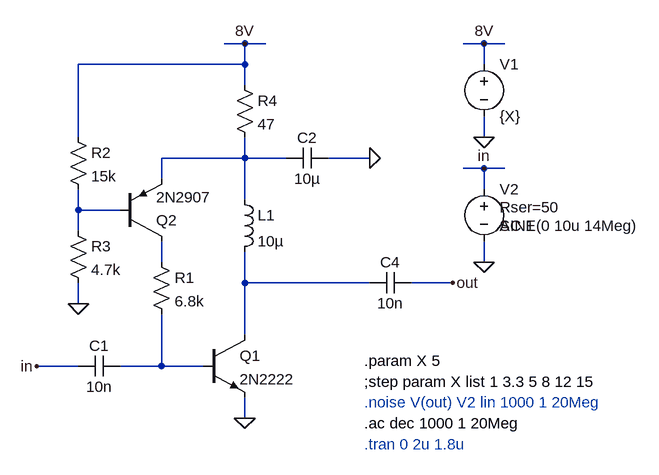
[diagram p0: schematic j-lna.asc]
j-lna.asc, the LTspice schematic file:
Version 4
SHEET 1 1132 680
WIRE 64 -176 32 -176
WIRE 96 -176 64 -176
WIRE 432 -176 400 -176
WIRE 464 -176 432 -176
WIRE 64 -144 64 -176
WIRE 64 -144 -192 -144
WIRE 432 -144 432 -176
WIRE 64 -112 64 -144
WIRE -192 -32 -192 -144
WIRE 432 -32 432 -64
WIRE 64 0 64 -32
WIRE 64 0 -64 0
WIRE 128 0 64 0
WIRE 256 0 192 0
WIRE 432 16 400 16
WIRE 464 16 432 16
WIRE -64 32 -64 0
WIRE 432 48 432 16
WIRE 64 64 64 0
WIRE -192 80 -192 48
WIRE -128 80 -192 80
WIRE -192 112 -192 80
WIRE -64 160 -64 128
WIRE 432 160 432 128
WIRE 64 192 64 144
WIRE 256 192 64 192
WIRE 384 192 320 192
WIRE -192 224 -192 192
WIRE 64 272 64 192
WIRE -192 320 -256 320
WIRE -64 320 -64 240
WIRE -64 320 -128 320
WIRE 0 320 -64 320
WIRE 64 400 64 368
FLAG 64 400 0
FLAG -192 224 0
FLAG 256 0 0
FLAG 432 -32 0
FLAG 432 -176 8V
FLAG 64 -176 8V
FLAG -256 320 in
FLAG 384 192 out
FLAG 432 160 0
FLAG 432 16 in
SYMBOL npn 0 272 R0
SYMATTR InstName Q1
SYMATTR Value 2N2222
SYMBOL ind 48 48 R0
SYMATTR InstName L1
SYMATTR Value 10µ
SYMBOL res -80 144 R0
SYMATTR InstName R1
SYMATTR Value 6.8k
SYMBOL cap -128 304 R90
WINDOW 0 0 32 VBottom 2
WINDOW 3 32 32 VTop 2
SYMATTR InstName C1
SYMATTR Value 10n
SYMBOL pnp -128 128 M180
SYMATTR InstName Q2
SYMATTR Value 2N2907
SYMBOL res -208 -48 R0
SYMATTR InstName R2
SYMATTR Value 15k
SYMBOL res -208 96 R0
SYMATTR InstName R3
SYMATTR Value 4.7k
SYMBOL res 48 -128 R0
SYMATTR InstName R4
SYMATTR Value 47
SYMBOL cap 192 -16 R90
WINDOW 0 0 32 VBottom 2
WINDOW 3 32 32 VTop 2
SYMATTR InstName C2
SYMATTR Value 10µ
SYMBOL voltage 432 -160 R0
WINDOW 123 0 0 Left 0
WINDOW 39 0 0 Left 0
SYMATTR InstName V1
SYMATTR Value {X}
SYMBOL voltage 432 32 R0
WINDOW 123 24 72 Left 2
WINDOW 39 24 44 Left 2
WINDOW 3 24 72 Left 2
SYMATTR Value2 AC 1
SYMATTR SpiceLine Rser=50
SYMATTR Value SINE(0 10u 14Meg)
SYMATTR InstName V2
SYMBOL cap 320 176 R90
WINDOW 0 0 32 VBottom 2
WINDOW 3 32 32 VTop 2
SYMATTR InstName C4
SYMATTR Value 10n
TEXT 248 440 Left 2 ;.tran 0 2u 1.8u
TEXT 248 408 Left 2 !.ac dec 1000 1 20Meg
TEXT 248 376 Left 2 ;.noise V(out) V2 lin 1000 1 20Meg
TEXT 248 344 Left 2 !;step param X list 1 3.3 5 8 12 15
TEXT 248 312 Left 2 !.param X 5

The netlist it stands for:
* j-lna.asc
Q1 N004 N005 0 0 2N2222
L1 N001 N004 10µ
R1 N003 N005 6.8k
C1 N005 in 10n
Q2 N003 N002 N001 0 2N2907
R2 8V N002 15k
R3 N002 0 4.7k
R4 8V N001 47
C2 0 N001 10µ
V1 8V 0 {X}
V2 in 0 SINE(0 10u 14Meg) AC 1 Rser=50
C4 out N004 10n
.model NPN NPN
.model PNP PNP
.lib standard.bjt
* .tran 0 2u 1.8u
.ac dec 1000 1 20Meg
* .noise V(out) V2 lin 1000 1 20Meg
;step param X list 1 3.3 5 8 12 15
.param X 5
.backanno
.end